# Altium schematic sheet min.SchDoc
size A; SheetNumber: 1; SheetTotal: 7
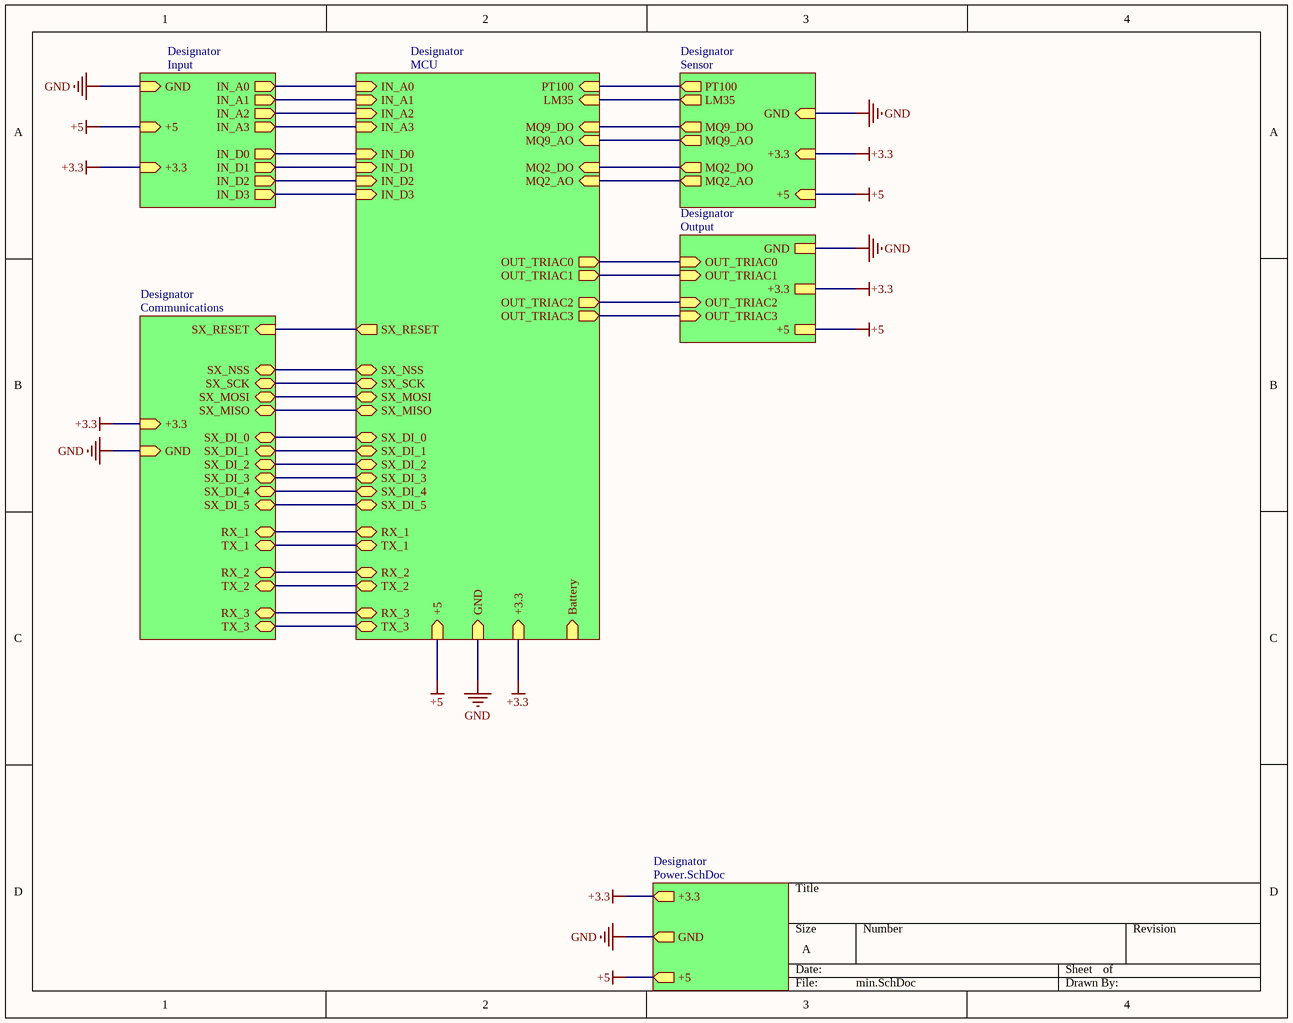
[diagram p0: min.SchDoc]

## Sub-sheets
Designator = Input: IN_D0 (out), IN_D1 (out), IN_A0 (out), IN_A1 (out), GND (in), +5 (in), +3.3 (in), IN_A2 (out), IN_A3 (out), IN_D2 (out), IN_D3 (out)
Designator = Power.SchDoc: GND (out), +5 (out), +3.3 (out)
Designator = Sensor: +5 (in), GND (in), PT100 (out), LM35 (out), MQ9_DO (out), MQ9_AO (out), MQ2_DO (out), MQ2_AO (out), +3.3 (in)
Designator = MCU: +3.3 (in), GND (in), +5 (in), IN_D0 (in), IN_D1 (in), IN_A0 (in), IN_A1 (in), OUT_TRIAC1 (out), OUT_TRIAC0 (out), PT100 (in), LM35 (in), MQ9_DO (in), MQ9_AO (in), MQ2_DO (in), MQ2_AO (in), SX_RESET (out), SX_NSS (bidir), SX_SCK (bidir), SX_MOSI (bidir), SX_MISO (bidir), Battery (in), SX_DI_0 (bidir), SX_DI_1 (bidir), SX_DI_2 (bidir), SX_DI_3 (bidir), SX_DI_4 (bidir), SX_DI_5 (bidir), RX_2 (bidir), RX_3 (bidir), TX_3 (bidir), TX_2 (bidir), RX_1 (bidir), TX_1 (bidir), IN_A2 (in), IN_A3 (in), IN_D2 (in), IN_D3 (in), OUT_TRIAC2 (out), OUT_TRIAC3 (out)
Designator = Communications: SX_RESET (in), SX_NSS (bidir), SX_SCK (bidir), SX_MOSI (bidir), SX_MISO (bidir), +3.3 (in), GND (in), SX_DI_0 (bidir), SX_DI_1 (bidir), SX_DI_2 (bidir), SX_DI_3 (bidir), SX_DI_4 (bidir), SX_DI_5 (bidir), RX_1 (bidir), TX_1 (bidir), RX_2 (bidir), RX_3 (bidir), TX_2 (bidir), TX_3 (bidir)
Designator = Output: GND, +3.3, +5, OUT_TRIAC0 (in), OUT_TRIAC1 (in), OUT_TRIAC2 (in), OUT_TRIAC3 (in)

## Nets
+3.3: sheet Designator/+3.3, sheet Designator/+3.3, sheet Designator/+3.3, sheet Designator/+3.3, sheet Designator/+3.3, sheet Designator/+3.3
+5: sheet Designator/+5, sheet Designator/+5, sheet Designator/+5, sheet Designator/+5, sheet Designator/+5
GND: sheet Designator/GND, sheet Designator/GND, sheet Designator/GND, sheet Designator/GND, sheet Designator/GND, sheet Designator/GND
(unnamed): sheet Designator/IN_D0, sheet Designator/IN_D0
(unnamed): sheet Designator/IN_D1, sheet Designator/IN_D1
(unnamed): sheet Designator/IN_A0, sheet Designator/IN_A0
(unnamed): sheet Designator/IN_A1, sheet Designator/IN_A1
(unnamed): sheet Designator/IN_A2, sheet Designator/IN_A2
(unnamed): sheet Designator/IN_A3, sheet Designator/IN_A3
(unnamed): sheet Designator/IN_D2, sheet Designator/IN_D2
(unnamed): sheet Designator/IN_D3, sheet Designator/IN_D3
(unnamed): sheet Designator/PT100, sheet Designator/PT100
(unnamed): sheet Designator/LM35, sheet Designator/LM35
(unnamed): sheet Designator/MQ9_DO, sheet Designator/MQ9_DO
(unnamed): sheet Designator/MQ9_AO, sheet Designator/MQ9_AO
(unnamed): sheet Designator/MQ2_DO, sheet Designator/MQ2_DO
(unnamed): sheet Designator/MQ2_AO, sheet Designator/MQ2_AO
(unnamed): sheet Designator/OUT_TRIAC1, sheet Designator/OUT_TRIAC1
(unnamed): sheet Designator/OUT_TRIAC0, sheet Designator/OUT_TRIAC0
(unnamed): sheet Designator/SX_RESET, sheet Designator/SX_RESET
(unnamed): sheet Designator/SX_NSS, sheet Designator/SX_NSS
(unnamed): sheet Designator/SX_SCK, sheet Designator/SX_SCK
(unnamed): sheet Designator/SX_MOSI, sheet Designator/SX_MOSI
(unnamed): sheet Designator/SX_MISO, sheet Designator/SX_MISO
(unnamed): sheet Designator/SX_DI_0, sheet Designator/SX_DI_0
(unnamed): sheet Designator/SX_DI_1, sheet Designator/SX_DI_1
(unnamed): sheet Designator/SX_DI_2, sheet Designator/SX_DI_2
(unnamed): sheet Designator/SX_DI_3, sheet Designator/SX_DI_3
(unnamed): sheet Designator/SX_DI_4, sheet Designator/SX_DI_4
(unnamed): sheet Designator/SX_DI_5, sheet Designator/SX_DI_5
(unnamed): sheet Designator/RX_2, sheet Designator/RX_2
(unnamed): sheet Designator/RX_3, sheet Designator/RX_3
(unnamed): sheet Designator/TX_3, sheet Designator/TX_3
(unnamed): sheet Designator/TX_2, sheet Designator/TX_2
(unnamed): sheet Designator/RX_1, sheet Designator/RX_1
(unnamed): sheet Designator/TX_1, sheet Designator/TX_1
(unnamed): sheet Designator/OUT_TRIAC2, sheet Designator/OUT_TRIAC2
(unnamed): sheet Designator/OUT_TRIAC3, sheet Designator/OUT_TRIAC3